# EAGLE design ESP32_SimButtonBox_Controller (EAGLE 9.6.2)
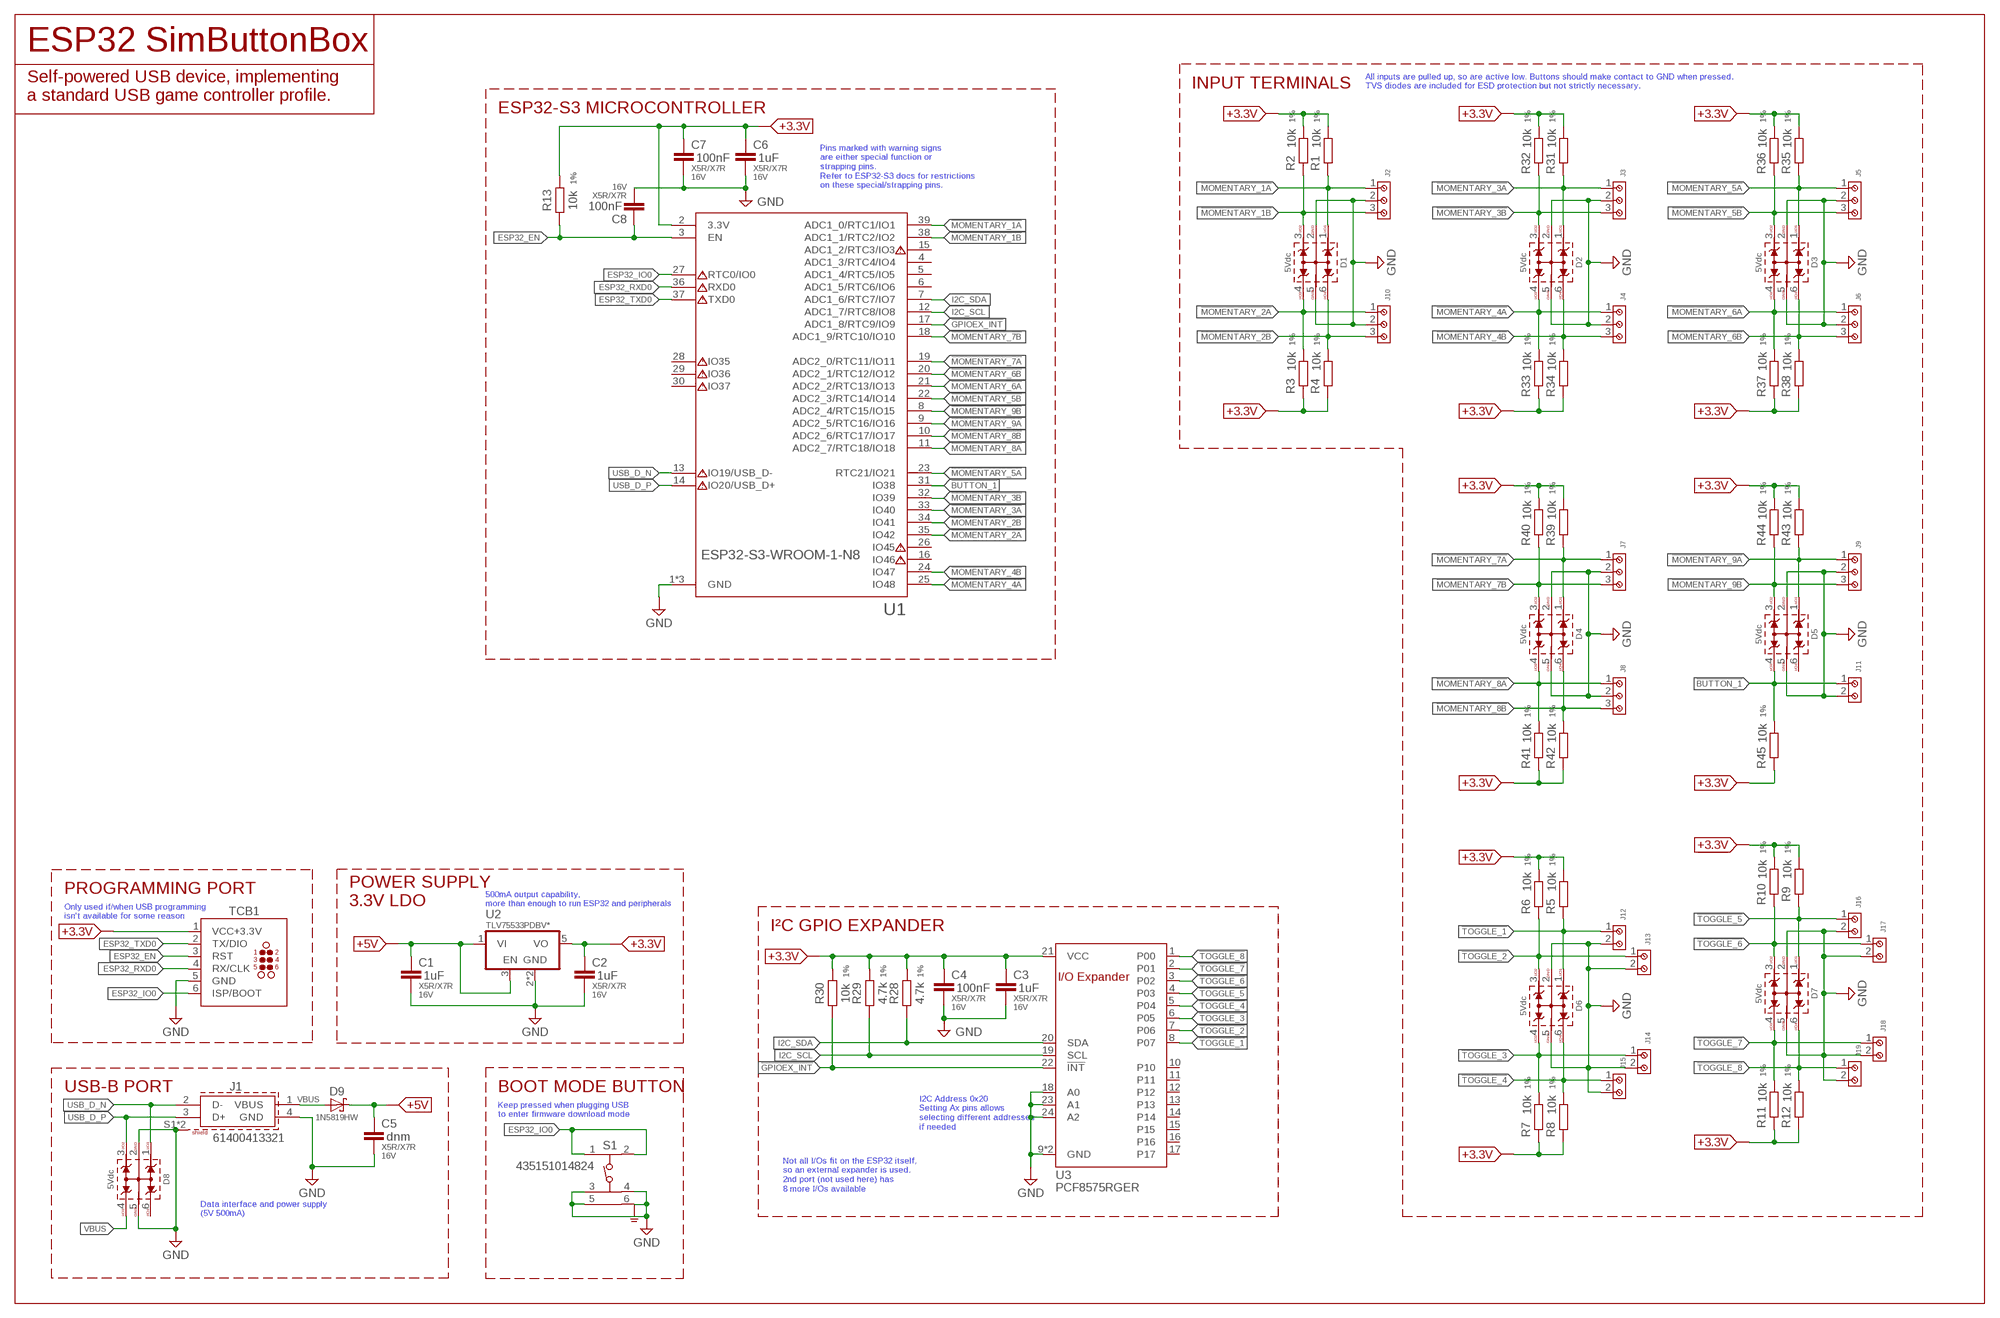
[diagram p0: schematic, sheet 1]

## Parts
C1  1uF  CAP_0603  [C0603]
C2  1uF  CAP_0603  [C0603]
C3  1uF  CAP_0603  [C0603]
C4  100nF  CAP_0603  [C0603]
C5  dnm  CAP_0603  [C0603]
C6  1uF  CAP_0603  [C0603]
C7  100nF  CAP_0603  [C0603]
C8  100nF  CAP_0603  [C0603]
D1  5Vdc  WE-TVS_SOT23-6L_82402304  [WE-TVS_SOT23-6L]
D2  5Vdc  WE-TVS_SOT23-6L_82402304  [WE-TVS_SOT23-6L]
D3  5Vdc  WE-TVS_SOT23-6L_82402304  [WE-TVS_SOT23-6L]
D4  5Vdc  WE-TVS_SOT23-6L_82402304  [WE-TVS_SOT23-6L]
D5  5Vdc  WE-TVS_SOT23-6L_82402304  [WE-TVS_SOT23-6L]
D6  5Vdc  WE-TVS_SOT23-6L_82402304  [WE-TVS_SOT23-6L]
D7  5Vdc  WE-TVS_SOT23-6L_82402304  [WE-TVS_SOT23-6L]
D8  5Vdc  WE-TVS_SOT23-6L_82402304  [WE-TVS_SOT23-6L]
D9  1N5819HW  SCHOTTKY_SOD123  [SOD123]
J1  61400413321  [61400413321]
J2  691210910003  [691210910003]
J3  691210910003  [691210910003]
J4  691210910003  [691210910003]
J5  691210910003  [691210910003]
J6  691210910003  [691210910003]
J7  691210910003  [691210910003]
J8  691210910003  [691210910003]
J9  691210910003  [691210910003]
J10  691210910003  [691210910003]
J11  691210910002  [691210910002]
J12  691210910002  [691210910002]
J13  691210910002  [691210910002]
J14  691210910002  [691210910002]
J15  691210910002  [691210910002]
J16  691210910002  [691210910002]
J17  691210910002  [691210910002]
J18  691210910002  [691210910002]
J19  691210910002  [691210910002]
R1  10k  RES_0603  [R0603]
R2  10k  RES_0603  [R0603]
R3  10k  RES_0603  [R0603]
R4  10k  RES_0603  [R0603]
R5  10k  RES_0603  [R0603]
R6  10k  RES_0603  [R0603]
R7  10k  RES_0603  [R0603]
R8  10k  RES_0603  [R0603]
R9  10k  RES_0603  [R0603]
R10  10k  RES_0603  [R0603]
R11  10k  RES_0603  [R0603]
R12  10k  RES_0603  [R0603]
R13  10k  RES_0603  [R0603]
R28  4.7k  RES_0603  [R0603]
R29  4.7k  RES_0603  [R0603]
R30  10k  RES_0603  [R0603]
R31  10k  RES_0603  [R0603]
R32  10k  RES_0603  [R0603]
R33  10k  RES_0603  [R0603]
R34  10k  RES_0603  [R0603]
R35  10k  RES_0603  [R0603]
R36  10k  RES_0603  [R0603]
R37  10k  RES_0603  [R0603]
R38  10k  RES_0603  [R0603]
R39  10k  RES_0603  [R0603]
R40  10k  RES_0603  [R0603]
R41  10k  RES_0603  [R0603]
R42  10k  RES_0603  [R0603]
R43  10k  RES_0603  [R0603]
R44  10k  RES_0603  [R0603]
R45  10k  RES_0603  [R0603]
S1  435151014824  435151014824  [435151014824]
TCB1  TC2030-MCP-NL  [TC2030-MCP-NL]
U1  ESP32-S3-WROOM-1-N8  [WROOM-1]
U2  LDO_EN_SOT23-5  [SOT23-5]
U3  PCF8575RGE  [QFN50P400X400X100-25T210N]

## Nets
!BUTTON_1: D5.4 J11.1 R45.2 U1.31(IO38)
!GPIOEX_INT: R30.1 U1.17(ADC1_8/RTC9/IO9) U3.22(!INT)
!MOMENTARY_1A: D1.1 J2.1 R1.1 U1.39(ADC1_0/RTC1/IO1)
!MOMENTARY_1B: D1.3 J2.3 R2.1 U1.38(ADC1_1/RTC2/IO2)
!MOMENTARY_2A: D1.4 J10.1 R3.2 U1.35(IO42)
!MOMENTARY_2B: D1.6 J10.3 R4.2 U1.34(IO41)
!MOMENTARY_3A: D2.1 J3.1 R31.1 U1.33(IO40)
!MOMENTARY_3B: D2.3 J3.3 R32.1 U1.32(IO39)
!MOMENTARY_4A: D2.4 J4.1 R33.2 U1.25(IO48)
!MOMENTARY_4B: D2.6 J4.3 R34.2 U1.24(IO47)
!MOMENTARY_5A: D3.1 J5.1 R35.1 U1.23(RTC21/IO21)
!MOMENTARY_5B: D3.3 J5.3 R36.1 U1.22(ADC2_3/RTC14/IO14)
!MOMENTARY_6A: D3.4 J6.1 R37.2 U1.21(ADC2_2/RTC13/IO13)
!MOMENTARY_6B: D3.6 J6.3 R38.2 U1.20(ADC2_1/RTC12/IO12)
!MOMENTARY_7A: D4.1 J7.1 R39.1 U1.19(ADC2_0/RTC11/IO11)
!MOMENTARY_7B: D4.3 J7.3 R40.1 U1.18(ADC1_9/RTC10/IO10)
!MOMENTARY_8A: D4.4 J8.1 R41.2 U1.11(ADC2_7/RTC18/IO18)
!MOMENTARY_8B: D4.6 J8.3 R42.2 U1.10(ADC2_6/RTC17/IO17)
!MOMENTARY_9A: D5.1 J9.1 R43.1 U1.9(ADC2_5/RTC16/IO16)
!MOMENTARY_9B: D5.3 J9.3 R44.1 U1.8(ADC2_4/RTC15/IO15)
!TOGGLE_1: D6.1 J12.1 R5.1 U3.8(P07)
!TOGGLE_2: D6.3 J13.1 R6.1 U3.7(P06)
!TOGGLE_3: D6.4 J14.1 R7.2 U3.6(P05)
!TOGGLE_4: D6.6 J15.1 R8.2 U3.5(P04)
!TOGGLE_5: D7.1 J16.1 R9.1 U3.4(P03)
!TOGGLE_6: D7.3 J17.1 R10.1 U3.3(P02)
!TOGGLE_7: D7.4 J18.1 R11.2 U3.2(P01)
!TOGGLE_8: D7.6 J19.1 R12.2 U3.1(P00)
+3.3V: C2.1 C3.1 C4.1 C6.1 C7.1 R1.2 R2.2 R3.1 R4.1 R5.2 R6.2 R7.1 R8.1 R9.2 R10.2 R11.1 R12.1 R13.2 R28.2 R29.2 R30.2 R31.2 R32.2 R33.1 R34.1 R35.2 R36.2 R37.1 R38.1 R39.2 R40.2 R41.1 R42.1 R43.2 R44.2 R45.1 TCB1.1(VCC+3.3V) U1.2(3.3V) U2.5(VO) U3.21(VCC)
+5V: C1.1 C5.1 D9.C U2.1(VI) U2.3(EN)
ESP32_EN: C8.1 R13.1 TCB1.3(RST) U1.3(EN)
ESP32_IO0: S1.1 S1.2 TCB1.6(ISP/BOOT) U1.27(RTC0/IO0)
ESP32_RXD0: TCB1.4(RX/CLK) U1.36(RXD0)
ESP32_TXD0: TCB1.2(TX/DIO) U1.37(TXD0)
GND: C1.2 C2.2 C3.2 C4.2 C5.2 C6.2 C7.2 C8.2 D1.2(GND) D1.5(GND) D2.2(GND) D2.5(GND) D3.2(GND) D3.5(GND) D4.2(GND) D4.5(GND) D5.2(GND) D5.5(GND) D6.2(GND) D6.5(GND) D7.2(GND) D7.5(GND) D8.2(GND) D8.5(GND) J1.4(GND) J1.S1(SHIELD) J1.S2(SHIELD) J2.2 J3.2 J4.2 J5.2 J6.2 J7.2 J8.2 J9.2 J10.2 J11.2 J12.2 J13.2 J14.2 J15.2 J16.2 J17.2 J18.2 J19.2 S1.3 S1.4 S1.5 S1.6 TCB1.5(GND) U1.1(GND) U1.40(GND) U1.P$1(GND) U2.2(GND) U2.4(GND) U3.9(GND) U3.18(A0) U3.23(A1) U3.24(A2) U3.25(GND)
I2C_SCL: R29.1 U1.12(ADC1_7/RTC8/IO8) U3.19(SCL)
I2C_SDA: R28.1 U1.7(ADC1_6/RTC7/IO7) U3.20(SDA)
USB_D_N: D8.1 J1.2(D-) U1.13(IO19/USB_D-)
USB_D_P: D8.3 J1.3(D+) U1.14(IO20/USB_D+)
VBUS: D8.4 D9.A J1.1(VBUS)
Unconnected: D5.6 D8.6 U1.4(ADC1_3/RTC4/IO4) U1.5(ADC1_4/RTC5/IO5) U1.6(ADC1_5/RTC6/IO6) U1.15(ADC1_2/RTC3/IO3) U1.16(IO46) U1.26(IO45) U1.28(IO35) U1.29(IO36) U1.30(IO37) U3.10 U3.11 U3.12 U3.13 U3.14 U3.15 U3.16 U3.17

## Notes on the sheet
- ESP32 SimButtonBox
- INPUT TERMINALS
- All inputs are pulled up, so are active low. Buttons should make contact to GND when pressed.
  TVS diodes are included for ESD protection but not strictly necessary.
- Self-powered USB device, implementing
  a standard USB game controller profile.
- ESP32-S3 MICROCONTROLLER
- Pins marked with warning signs
  are either special function or
  strapping pins.
  Refer to ESP32-S3 docs for restrictions
  on these special/strapping pins.
- PROGRAMMING PORT
- POWER SUPPLY
  3.3V LDO
- 500mA output capability,
  more than enough to run ESP32 and peripherals
- Only used if/when USB programming
  isn't available for some reason
- I²C GPIO EXPANDER
- USB-B PORT | BOOT MODE BUTTON
- Keep pressed when plugging USB
  to enter firmware download mode
- I2C Address 0x20
  Setting Ax pins allows
  selecting different addresses
  if needed
- Not all I/Os fit on the ESP32 itself,
  so an external expander is used.
  2nd port (not used here) has 
  8 more I/Os available
- Data interface and power supply
  (5V 500mA)

## Library data of the parts
C1-C8 = Onwi.Capacitor:CAP: Capacitor; BOM_CAT: C_SMD; MATERIAL: X5R/X7R; VOLTAGE: 16V
D1-D8 = Wurth_EMC Components_WE-TVS:WE-TVS_SOT23-6L_82402304: WE-TVS TVS Diode – Standard Series Characteristics Fast turn-on Low clamping voltage High ESD withstand voltage Uni- or bidirectional protection Small package Epoxy flame resistant UL94 V-0 Applications DC power supply USB Power Delivery (PD) Headsets and accessories PDAs Digital cameras MP3-Player Touch Panels Notebooks ESD, EFT and Surge Protection ESD protection in accordance with EN 61000-4-2 – 8 kV contact discharge – 15 kV air discharge <https://www.we-online.com/catalog/media/o106433v209%20Family_WE-TVS_Standard.jpg> Details see: https://www.we-online.com/catalog/en/WE-TVS Updated by Ella Wu 2019-07-12 2019 (C) Wurth Elektronik; C-CH: 13pF; CHANNELS: 4; DATASHEET-URL: https://www.we-online.com/catalog/datasheet/82402304.pdf; DESCRIPTION: WE-TVS TVS Diode; IPEAK: 6A; MF: Wurth Elektronik; MOUNT: SMT; MP: 82402304; VBR: 6V
D9 = Onwi.Diode:SCHOTTKY: Schottky Diode; CURRENT: 1A; DESCRIPTION: Schottky diode; MP: 1N5819HW
J1 = Wurth_Connectors_WR-USB:61400413321: WR-COM USB 2.0 Type B Vertical Kind Properties Durability:1500 Mating cycles Connector Type:USB Gender:Receptacle Type:Vertical General Information Operating Temperature:-40up to +105 °C Electrical Properties Working Voltage:30V (AC) Withstanding Voltage:750V (AC) Contact Resistance:20 mΩ Material Properties Insulator Material:PBT Insulator Flammability Rating:UL94 V-0 Color:White Cover Material:Brass Cover Plating:Nickel Contact Material:Copper Alloy Contact Plating:Selective Gold Contact Type:Stamped Shielding Material:Brass Shielding Plating:Nickel <https://www.we-online.com/catalog/media/o32829v209%20Family_S290_WR-COM_USB_TypeB_61400413321_4C.jpg> Details see: https://www.we-online.com/catalog/en/COM_TYPE_B_VERTICAL/ Updated by Yingchun, Shan 2020-01-16 2020 (C) Würth Elektronik; APPLICATION: USB 2.0; DATASHEET-URL: https://www.we-online.com/catalog/datasheet/61400413321.pdf; DESCRIPTION: WR-USB Input/Output USB connectors; GERDER: Receptacle; INTERFACE-TYPE: Type B; IR1: 1.5A; MF: Wurth Elktronik; MOUNT: THT; MP: 61400413321; PACKAGING: Tray; PINS: 4; REF-EXCALIBUR: 03178; TYPE: Vertical; WORKING-VOLTAGE: 30V(AC)
J2-J10 = Wurth_Connectors_WR-TBL Rising Cage Clamp:691210910003: WR-TBL Serie 2109 - 2.54 mm Horiz. Entry KIND PROPERTIES Pitch 2.54 mm MATERIAL PROPERTIES Insulator Material PA66 Insulator Flammability Rating UL94 V-0 Insulator Color Green Contact Material Brass Contact Plating Copper over Zinc Terminal Screw Material Steel Terminal Screw Plating Zinc Wire Guard Material Brass GENERAL INFORMATION Operating Temperature -40 up to +105 °C Compliance Lead free / RoHS ELECTRICAL PROPERTIES IR cULus 6 A Working Voltage [cULus] 150 V (AC) Withstanding Voltage [cULus] 1300 V (AC) Contact Resistance [cULus] 20 mΩ MECHANICAL PROPERTIES Wire Strip Length 4 up to 5 (mm) Screw M1.6 Solid Wire Section (AWG) 30 to 18 (AWG) Solid Wire Section (Metric) 0.0509 to 0.823 (mm²) Stranded Wire Section (AWG) 30 to 18 (AWG) Stranded Wire Section (Metric) 0.0509 to 0.823 (mm²) CERTIFICATION cULus Approval E315414 PACKAGING PROPERTIES Packaging Box <https://katalog.we-online.com/media/images/v2/o33231v209%20Family_WR-TBL_69121091000x.jpg> Details see: https://katalog.we-online.com/en/em/TBL_2_54_2109_HORIZONTAL_ENTRY_69121091000X Updated by Ella Wu 2019-11-12 2019(C) Wurth Elektronik; DATASHEET-URL: https://www.we-online.com/catalog/datasheet/691210910003.pdf; DESCRIPTION: WR-TBL Rising Cage Clamp; IR-UL: 6A; MF: Wurth Elektronik; MOUNT: THT; MP: 691210910003; PINS: 3; PITCH: 2.54mm; TYPE: Horizontal; WIRE: 30 to 18 (AWG) 0.0509 to 0.823 (mm²); WORKING-VOLTAGE-UL: 150V (AC)
J11-J19 = Wurth_Connectors_WR-TBL Rising Cage Clamp:691210910002: WR-TBL Serie 2109 - 2.54 mm Horiz. Entry KIND PROPERTIES Pitch 2.54 mm MATERIAL PROPERTIES Insulator Material PA66 Insulator Flammability Rating UL94 V-0 Insulator Color Green Contact Material Brass Contact Plating Copper over Zinc Terminal Screw Material Steel Terminal Screw Plating Zinc Wire Guard Material Brass GENERAL INFORMATION Operating Temperature -40 up to +105 °C Compliance Lead free / RoHS ELECTRICAL PROPERTIES IR cULus 6 A Working Voltage [cULus] 150 V (AC) Withstanding Voltage [cULus] 1300 V (AC) Contact Resistance [cULus] 20 mΩ MECHANICAL PROPERTIES Wire Strip Length 4 up to 5 (mm) Screw M1.6 Solid Wire Section (AWG) 30 to 18 (AWG) Solid Wire Section (Metric) 0.0509 to 0.823 (mm²) Stranded Wire Section (AWG) 30 to 18 (AWG) Stranded Wire Section (Metric) 0.0509 to 0.823 (mm²) CERTIFICATION cULus Approval E315414 PACKAGING PROPERTIES Packaging Box <https://katalog.we-online.com/media/images/v2/o33231v209%20Family_WR-TBL_69121091000x.jpg> Details see: https://katalog.we-online.com/en/em/TBL_2_54_2109_HORIZONTAL_ENTRY_69121091000X Updated by Ella Wu 2019-11-12 2019(C) Wurth Elektronik; DATASHEET-URL: https://www.we-online.com/catalog/datasheet/691210910002.pdf; DESCRIPTION: WR-TBL Rising Cage Clamp; IR-UL: 6A; MF: Wurth Elektronik; MOUNT: THT; MP: 691210910002; PINS: 2; PITCH: 2.54mm; TYPE: Horizontal; WIRE: 30 to 18 (AWG) 0.0509 to 0.823 (mm²); WORKING-VOLTAGE-UL: 150V (AC)
R1-R13 R28-R45 = Onwi.Resistors:RES: Resistor; BOM_CAT: R_SMD; TOLERANCE: 1%
S1 = Wurth_Switch_WS-TASV:435151014824: WS-TASV SMT Tact Switch 3.0 x 2.6 mm with ground terminal MATERIAL PROPERTIES Cover Material Stainless Steel PROPERTIES Actuator Material LCP Actuator Flammability Rating UL94 V-0 Actuator Color White;​ Salmon;​ Black Frame Material LCP Frame Flammability Rating UL94 V-0 Frame Color Black Contact Material Stainless Steel Contact Plating Silver Terminal Material Copper Alloy Terminal Plating Silver VR 12 V (DC) Contact Resistance Initial 100 mΩ Contact Resistance After Life Test 2 Ω RISO 100 MΩ Withstanding Voltage 250 V (AC) Washable No Qty. 9500 GENERAL INFORMATION Operating Temperature -40 up to +85 °C PACKAGING PROPERTIES Packaging Tape and Reel <https://www.we-online.com/catalog/media/o158914v209%20WS-TASV-4351x10148xx_a.jpg> Details see: https://katalog.we-online.com/en/em/WS_TASV_SMT_TACT_SWITCH_3_x_2_6 Updated by Ella Wu 2020-11-18 2020(C) Wurth Elektronik; DATASHEET-URL: https://www.we-online.com/catalog/datasheet/435151014824 .pdf; DESCRIPTION: WS-TASV Switches - Tact Switches; H: 1.4mm; MF: Wurth Elektronik; MP: 435151014824; OPERATION-FORCE: 240g
TCB1 = Onwi.Connector:TC2030: TAG-CONNECT ICSP Connector; NOT_IN_BOM: true
U1 = Onwi.Microcontroller:ESP32-S3-WROOM-1: Module Overview Features CPU and On-Chip Memory • ESP32-S3 series of SoCs embedded, Xtensa® dual-core 32-bit LX7 microprocessor, up to 240 MHz • 384 KB ROM • 512 KB SRAM • 16 KB SRAM in RTC • Up to 8 MB PSRAM Wi-Fi • 802.11 b/g/n • Bit rate: 802.11n up to 150 Mbps • A-MPDU and A-MSDU aggregation • 0.4 µs guard interval support • Center frequency range of operating channel: 2412 ~ 2484 MHz Bluetooth • Bluetooth LE: Bluetooth 5, Bluetooth mesh • Speed: 125 Kbps, 500 Kbps, 1 Mbps, 2 Mbps • Advertising extensions • Multiple advertisement sets • Channel selection algorithm #2 • Internal co-existence mechanism between Wi-Fi and Bluetooth to share the same antenna Peripherals • GPIO, SPI, LCD interface, Camera interface, UART, I2C, I2S, remote control, pulse counter,LED PWM, USB 1.1 OTG, USB Serial/JTAG controller, MCPWM, SDIO host, GDMA, TWAI® controller (compatible with ISO 11898-1), ADC, touch sensor, temperature sensor, timers and watchdogs Integrated Components on Module • 40 MHz crystal oscillator • Up to 16 MB Quad SPI flash Antenna Options • On-board PCB antenna (ESP32-S3-WROOM-1) • External antenna via a connector (ESP32-S3-WROOM-1U) Operating Conditions • Operating voltage/Power supply: 3.0 ~ 3.6 V • Operating ambient temperature: – 65 °C version: –40 ~ 65 °C – 85 °C version: –40 ~ 85 °C – 105 °C version: –40 ~ 105 °C Certification • RF certification: See certificates • Green certification: RoHS/REACH; DESCRIPTION: Modules multiprotocoles SMD Module, ESP32-S3, 8 MB SPI Flash, PCB Antenna; MF: Espressif Systems; MP: ESP32-S3-WROOM-1-N8
U2 = Onwi.LDO:LDO_EN: LDO with Enable pin; DESCRIPTION: LDO; IOUT: 500mA; MF: Texas Instruments; MP: TLV75533PDBV*; VMAX: 5.5V; VMIN: 1.45V
U3 = Onwi.GPIO_Expander:PCF8575: Texas Instruments PCF8575 16-bit 2.5- to 5.5-V I2C/SMBus I/O expander with interrupt; DESCRIPTION: 16bit I2C IO Expander; MF: Texas Instruments; MP: PCF8575RGER

## Board
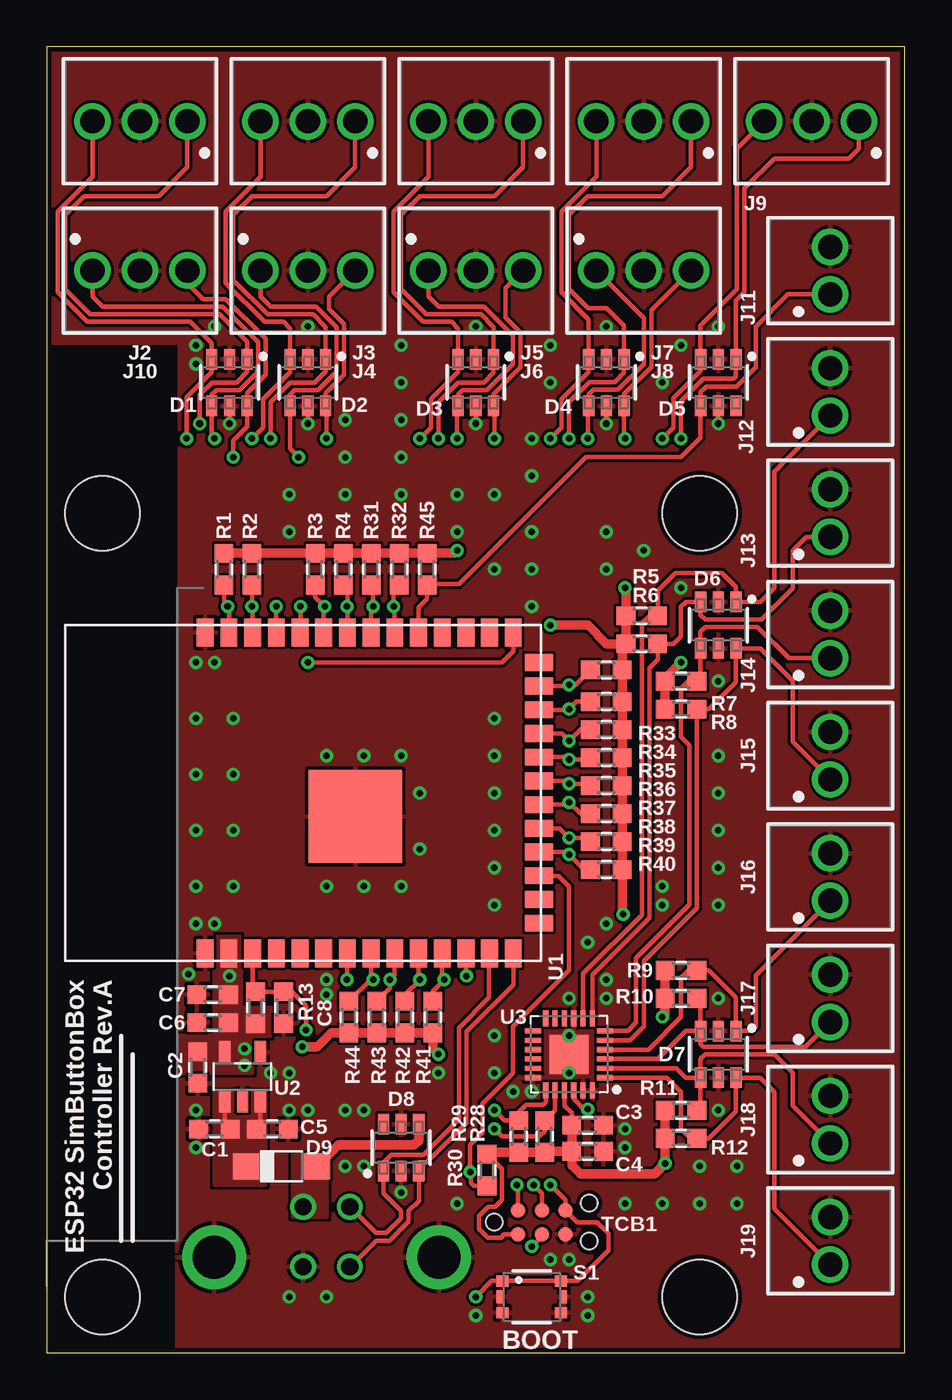
[diagram p1: board, top side]
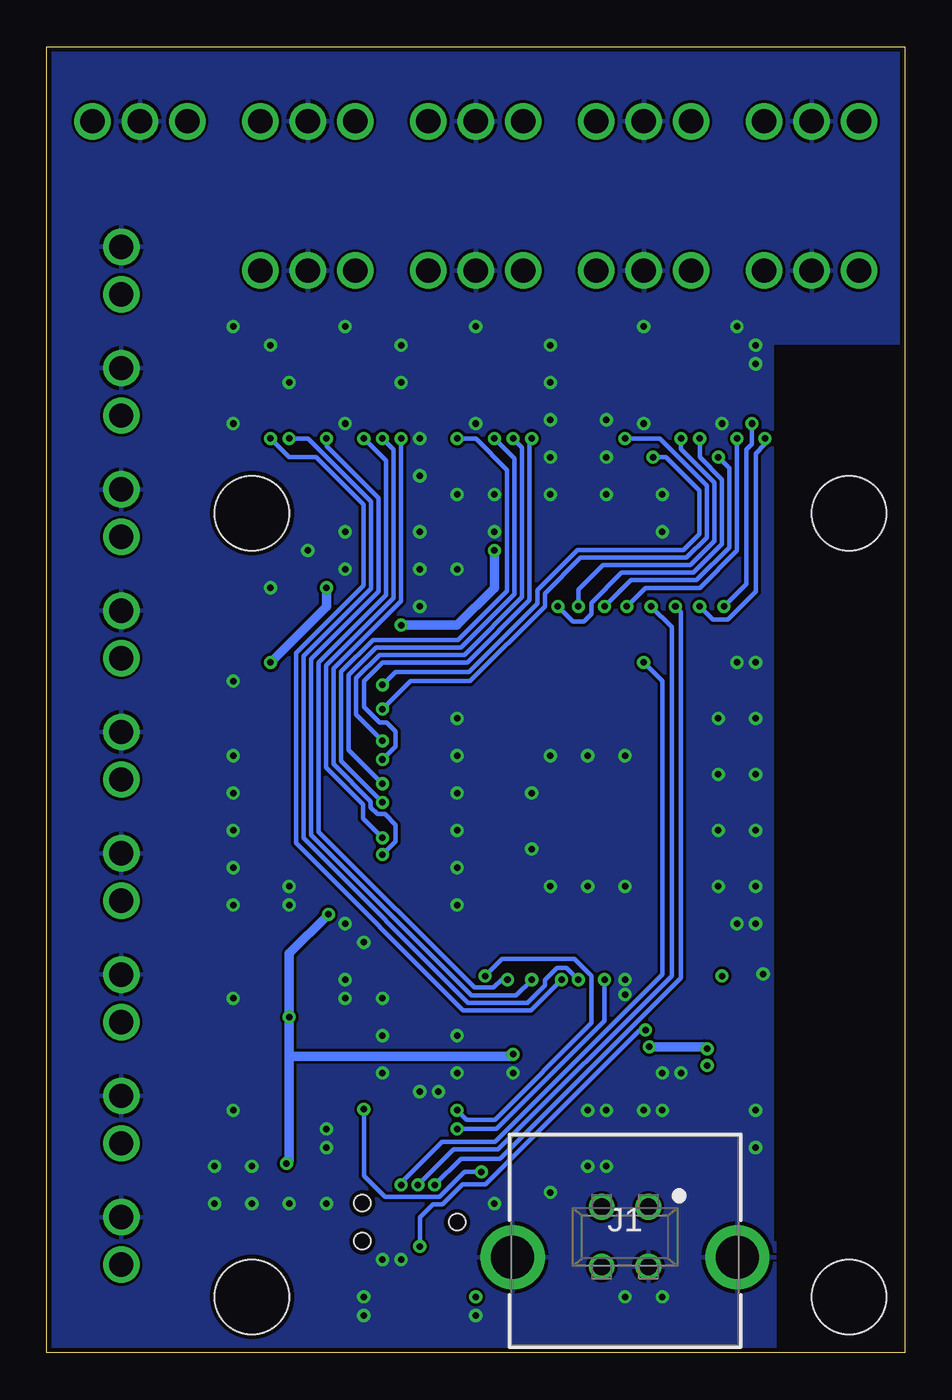
[diagram p2: board, bottom side, seen from below]

Size 46 x 70 mm. Coordinates in mm from the lower left corner, seen from the top.
Outline: 0,0 46,0 46,70 0,70 0,0
Copper layers (1*16): Top 0.018mm / dielectric 1.55mm / Bottom 0.018mm
Design rules "ONWI-2layer-Default": minimum track width 0.15mm, minimum drill 0.25mm, track to track 0.15mm, track to pad 0.15mm, pad to pad 0.15mm, via to via 0.15mm, smd to smd 0mil, copper to edge 0.25mm, drill to drill 0.35mm, minimum pad ring 0.175mm, minimum via ring 0.175mm, stop-mask expansion 0mil, vias tented up to drill 0.45mm, thermal gap 0.2mm
Holes 4 mm at 3,3 35,3 3,45 35,45

### Footprints (pad centres in the part's own frame; a part is rotated, then mirrored left to right if it is on the bottom)
C0603 = smd 1 x 1: 1 -0.85,0; 2 0.85,0
WE-TVS_SOT23-6L = smd 0.6 x 1.1: 1 -0.95,-1.25; 2 0,-1.25; 3 0.95,-1.25; 4 0.95,1.25; 5 0,1.25; 6 -0.95,1.25
SOD123 = smd 1.4 x 1.4: A 1.9,0; C -1.9,0
61400413321 = drill 0.92: 1 1.25,1.82; 2 -1.25,1.82; 3 -1.25,-1.38; 4 1.25,-1.38 | drill 2.3: S1 -6.02,-0.88; S2 6.02,-0.88
691210910003 = drill 1.3: 1 -2.54,0; 2 0,0; 3 2.54,0
691210910002 = drill 1.3: 1 -1.27,0; 2 1.27,0
R0603 = smd 1 x 1: 1 -0.85,0; 2 0.85,0
435151014824 = smd 0.65 x 0.6: 1 -1.575,0.85; 2 1.575,0.85; 3 -1.575,-0.85; 4 1.575,-0.85 | smd 0.35 x 0.7: 5 -1.725,0; 6 1.725,0
TC2030-MCP-NL = smd 0.787 x 0.787: 1 1.27,-0.635; 2 1.27,0.635; 3 2.54,-0.635; 4 2.54,0.635; 5 3.81,-0.635; 6 3.81,0.635 | hole 0.889: 0,0; 5.08,-1.016; 5.08,1.016
WROOM-1 = smd 1.5 x 0.9: 1 -8.6,5; 2 -8.6,3.73; 3 -8.6,2.46; 4 -8.6,1.19; 5 -8.6,-0.08; 6 -8.6,-1.35; 7 -8.6,-2.62; 8 -8.6,-3.89; 9 -8.6,-5.16; 10 -8.6,-6.43; 11 -8.6,-7.7; 12 -8.6,-8.97; 13 -8.6,-10.24; 14 -8.6,-11.51; 27 8.6,-11.51; 28 8.6,-10.24; 29 8.6,-8.97; 30 8.6,-7.7; 31 8.6,-6.43; 32 8.6,-5.16; 33 8.6,-3.89; 34 8.6,-2.62; 35 8.6,-1.35; 36 8.6,-0.08; 37 8.6,1.19; 38 8.6,2.46; 39 8.6,3.73; 40 8.6,5 | smd 0.9 x 1.5: 15 -6.97,-12.9; 16 -5.7,-12.9; 17 -4.43,-12.9; 18 -3.16,-12.9; 19 -1.89,-12.9; 20 -0.62,-12.9; 21 0.65,-12.9; 22 1.92,-12.9; 23 3.19,-12.9; 24 4.46,-12.9; 25 5.73,-12.9; 26 7,-12.9 | smd 5 x 5: P$1 -1.25,-3.05
SOT23-5 = smd 0.6 x 1.2: 1 -0.95,-1.306; 2 0,-1.306; 3 0.95,-1.306; 4 0.95,1.306; 5 -0.95,1.306
QFN50P400X400X100-25T210N = smd 0.86 x 0.27: 1 -1.935,1.25; 2 -1.935,0.75; 3 -1.935,0.25; 4 -1.935,-0.25; 5 -1.935,-0.75; 6 -1.935,-1.25; 13 1.935,-1.25; 14 1.935,-0.75; 15 1.935,-0.25; 16 1.935,0.25; 17 1.935,0.75; 18 1.935,1.25 | smd 0.27 x 0.86: 7 -1.25,-1.935; 8 -0.75,-1.935; 9 -0.25,-1.935; 10 0.25,-1.935; 11 0.75,-1.935; 12 1.25,-1.935; 19 1.25,1.935; 20 0.75,1.935; 21 0.25,1.935; 22 -0.25,1.935; 23 -0.75,1.935; 24 -1.25,1.935 | smd 2.1 x 2.1: 25 0,0

### Placement (x,y rotation side)
C1  9,12 180 top
C2  8.1,15.3 270 top
C3  29,12.2 0 top
C4  29,10.8 0 top
C5  12.1,12 0 top
C6  8.9,17.7 180 top
C7  8.9,19.2 180 top
C8  12.7,18.5 270 top
D1  9.8,52 180 top
D2  14,52 180 top
D3  23,52 180 top
D4  30,52 180 top
D5  36,52 180 top
D6  36,39 180 top
D7  36,16 180 top
D8  19,11 0 top
D9  12.6,10 0 top
J1  15,6 0 bottom
J2  5,66 180 top
J3  14,66 180 top
J4  14,58 0 top
J5  23,66 180 top
J6  23,58 0 top
J7  32,66 180 top
J8  32,58 0 top
J9  41,66 180 top
J10  5,58 0 top
J11  42,58 90 top
J12  42,51.5 90 top
J13  42,45 90 top
J14  42,38.5 90 top
J15  42,32 90 top
J16  42,25.5 90 top
J17  42,19 90 top
J18  42,12.5 90 top
J19  42,6 90 top
R1  9.5,42 90 top
R2  11,42 90 top
R3  14.4,42 270 top
R4  15.9,42 270 top
R5  31.9,39.5 180 top
R6  31.9,38 180 top
R7  34,36 0 top
R8  34,34.5 0 top
R9  34,20.5 180 top
R10  34,19 180 top
R11  34,13 0 top
R12  34,11.5 0 top
R13  11.2,18.5 270 top
R28  26.7,11.6 270 top
R29  25.3,11.6 270 top
R30  23.6,9.8 90 top
R31  17.4,42 90 top
R32  18.9,42 90 top
R33  30,36.6 180 top
R34  30,34.9 180 top
R35  30,33.4 0 top
R36  30,31.9 0 top
R37  30,30.4 180 top
R38  30,28.9 180 top
R39  30,27.4 0 top
R40  30,25.9 0 top
R41  20.7,18 90 top
R42  19.2,18 90 top
R43  17.7,18 270 top
R44  16.2,18 270 top
R45  20.4,42 270 top
S1  26,3 0 top
TCB1  24,7 0 top
U1  13.5,30 90 top
U2  10.5,14.8 0 top
U3  28,16 180 top
U$1  [PCB-SPEC]  60,0 0 top  (outside the outline)

### Tracks (layer width: path | path; a pad name or v marks a point on that pad's centre or on a via)
!BUTTON_1
  Top 0.254: J11.1 39.73,56.73 38,55 38,52.83 36.97,51.79 35.37,51.79 35.05,51.48 D5.4 35.05,49.05 34,48 28.9,48 22.1,41.2 20.45,41.2 R45.2 20.4,40.4 19.93,39.93 U1.31
!GPIOEX_INT  (via drill 0.35)
  Top 0.254: v29,13.06 28.8,13.06 28.25,13.61 U3.22 | R30.1 22.9,8.95 22.75,9.1 22.75,9.65 v22.7,9.7 22.7,11.14 23.37,11.81 23.37,13.37 25,15 25,17.5 28,20.5 28,25 27.43,25.57 U1.17
  Bottom 0.254: v22.7,9.7 23.61,9.7 24.94,8.37 27.87,8.37 29,9.5 v29,13.06
!MOMENTARY_1A  (via drill 0.35)
  Top 0.254: J2.1 7.54,63.54 6,62 2,62 1,61 1,57 2.34,55.66 9.27,55.66 10.75,54.18 D1.1 10.75,52.58 10.17,52 8.86,52 8.2,51.34 v8.2,49.8 | U1.39 9.77,39.93 v9.7,40 9.5,40.2 R1.1
  Bottom 0.254: v8.2,49.8 8.2,48.7 8.5,48.4 8.5,41.2 v9.7,40
!MOMENTARY_1B  (via drill 0.35)
  Top 0.254: J2.3 2.46,63.03 0.6,61.17 0.6,56.83 2.17,55.25 7.7,55.25 8.85,54.1 D1.3 8.85,52.56 7.5,51.21 v7.5,49 | U1.38 11.04,39.96 v11,40 R2.1
  Bottom 0.254: v7.5,49 7.5,48.7 8,48.2 8,40.8 9.5,39.3 10.3,39.3 v11,40
!MOMENTARY_2A  (via drill 0.35)
  Top 0.254: J10.1 2.46,56.6 3,56.06 9.44,56.06 11.33,54.17 11.33,52.59 10.34,51.6 9.1,51.6 8.85,51.35 D1.4 8.85,49.15 v9,49 | U1.35 14.85,39.95 v14.9,40 14.4,40.5 R3.2
  Bottom 0.254: v14.9,40 13.9,41 11,41 9,43 v9,49
!MOMENTARY_2B  (via drill 0.35)
  Top 0.254: J10.3 7.54,57.33 8.4,56.47 9.61,56.47 11.73,54.34 11.73,52.42 10.75,51.44 D1.6 10.75,49.65 10,48.9 v10,48 | U1.34 16.12,39.98 | 16.12,39.98 v16.1,40 | R4.2 16.12,40.93 16.12,39.98
  Bottom 0.254: v16.1,40 14.7,41.4 11.17,41.4 9.4,43.17 9.4,47.4 v10,48
!MOMENTARY_3A  (via drill 0.35)
  Top 0.254: J3.1 16.54,63.54 15,62 11,62 10,61 10,57.5 11.84,55.66 14.27,55.66 14.95,54.98 D2.1 14.95,52.58 14.37,52 13.06,52 12,50.94 v12,49 | U1.33 17.39,39.89 v17.5,40 17.5,41.05 R31.1
  Bottom 0.254: v17.5,40 17.5,40.9 16.19,42.21 11.5,42.21 10.21,43.5 10.21,46.64 12,48.43 v12,49
!MOMENTARY_3B  (via drill 0.35)
  Top 0.254: J3.3 11.46,63.03 9.59,61.17 9.59,57.33 11.67,55.25 12.7,55.25 13.05,54.9 D2.3 13.05,52.56 11.6,51.11 11.6,49.6 v11,49 | U1.32 18.66,39.94 v18.6,40 18.6,40.85 R32.1
  Bottom 0.254: v18.6,40 17.8,39.2 17.2,39.2 16.8,39.6 16.8,40.19 15.18,41.81 11.34,41.81 9.81,43.34 9.81,46.81 11,48 v11,49
!MOMENTARY_4A  (via drill 0.35)
  Top 0.254: J4.1 11.46,56.61 12.01,56.06 14.44,56.06 15.53,54.97 15.53,52.59 14.54,51.6 13.3,51.6 13,51.3 13,50.8 D2.4 13.05,48.45 v13.5,48 | U1.25 27.93,35.73 v28,35.8 28.35,35.8 R33.2
  Bottom 0.254: v13.5,48 12.8,48 11.02,46.22 11.02,43.87 11.87,43.02 17.55,43.02 19.7,40.87 19.7,40.17 23.37,36.5 27.3,36.5 v28,35.8
!MOMENTARY_4B  (via drill 0.35)
  Top 0.254: J4.3 15.14,56.6 15.14,55.94 15.93,55.14 15.93,52.42 14.95,51.44 D2.6 15,50.7 v15,49 | U1.24 27.96,34.46 v28,34.5 28.4,34.9 R34.2
  Bottom 0.254: v28,34.5 26.5,36 23.3,36 19.3,40 19.3,40.7 17.38,42.62 11.7,42.62 10.62,43.7 10.62,46.47 13.14,49 v15,49
!MOMENTARY_5A  (via drill 0.35)
  Top 0.254: J5.1 25.54,63.54 24,62 20,62 19,61 19,57 20.34,55.66 23.27,55.66 23.95,54.98 D3.1 23.95,52.52 23.43,52 22.06,52 21,50.94 v21,49 | U1.23 27.61,33.19 v28,32.8 28.6,33.4 R35.1
  Bottom 0.254: v28,32.8 29.4,34.2 29.4,36.17 28.17,37.4 23.61,37.4 20.51,40.5 20.51,48.51 v21,49
!MOMENTARY_5B  (via drill 0.35)
  Top 0.254: J5.3 20.46,63.03 18.59,61.17 18.59,56.83 20.17,55.25 21.7,55.25 22.05,54.9 D3.3 22.05,52.56 20.6,51.11 20.6,49.6 v20,49 | U1.22 27.88,31.92 v28,31.8 29.05,31.8 R36.1
  Bottom 0.254: v28,31.8 27.3,32.5 27.3,33.3 27.77,33.77 28.16,33.77 29,34.61 29,36 28,37 23.44,37 20.11,40.34 20.11,48.89 v20,49
!MOMENTARY_6A  (via drill 0.35)
  Top 0.254: J6.1 20.46,56.6 21,56.06 23.44,56.06 25,54.51 25,53 23.6,51.6 22.3,51.6 22.05,51.35 D3.4 22,50.7 v22,49 | U1.21 27.85,30.65 v28,30.5 29.05,30.5 R37.2
  Bottom 0.254: v28,30.5 29.81,32.31 29.81,36.34 28.34,37.81 23.78,37.81 20.92,40.67 20.92,47.92 v22,49
!MOMENTARY_6B  (via drill 0.35)
  Top 0.254: J6.3 24.6,57.06 24.6,55.48 25.41,54.67 25.41,52.83 23.95,51.38 D3.6 24,50.7 v24,49 | U1.20 27.88,29.38 v28,29.5 28.6,28.9 R38.2
  Bottom 0.254: v28,29.5 30.21,31.71 30.21,36.5 28.5,38.21 23.95,38.21 21.32,40.84 21.32,47.32 23,49 v24,49
!MOMENTARY_7A  (via drill 0.35)
  Top 0.254: J7.1 34.54,63.54 33,62 29,62 28,61 28,57 29,56 30,56 30.95,55.05 D4.1 30.95,52.52 30.45,52.02 29.08,52.02 28,50.94 v28,49 | U1.19 27.49,28.11 v28,27.6 28.95,27.6 R39.1
  Bottom 0.254: v28,27.6 29.03,28.63 29.03,29.39 31.02,31.38 31.02,36.84 27.4,40.45 27.4,48.4 v28,49
!MOMENTARY_7B  (via drill 0.35)
  Top 0.254: J7.3 29.46,63.03 27.59,61.17 27.59,56.83 29.05,55.38 D4.3 29.05,52.56 27.6,51.11 27.6,49.6 v27,49 | U1.18 27.86,26.84 v28,26.7 28.8,25.9 R40.1
  Bottom 0.254: v28,26.7 27.3,27.4 27.3,28.3 27.87,28.87 28.26,28.87 28.63,29.24 28.63,29.56 30.62,31.55 30.62,36.67 27,40.28 v27,49
!MOMENTARY_8A  (via drill 0.35)
  Top 0.254: J8.1 32,55.46 32,53 30.62,51.62 29.32,51.62 29.05,51.35 D4.4 29,50.7 v29,49 | U1.11 21.2,20.1 v21.3,20 20.7,19.4 R41.2
  Bottom 0.254: v21.3,20 21.61,20 22.04,19.57 23.07,19.57 31.42,27.92 31.42,37 27.81,40.62 27.81,47.81 v29,49
!MOMENTARY_8B  (via drill 0.35)
  Top 0.254: J8.3 32.41,55.87 32.41,52.83 30.95,51.38 D4.6 30.95,49.05 v31,49 | U1.10 19.93,20.07 v20,20 19.2,19.2 R42.2
  Bottom 0.254: v20,20 20.83,19.17 23.24,19.17 31.83,27.76 31.83,37.17 28.21,40.79 28.21,45.81 31,48.6 v31,49
!MOMENTARY_9A  (via drill 0.35)
  Top 0.254: J9.1 43.54,64.54 43,64 39,64 37.41,62.41 37.41,56.83 36.95,56.38 D5.1 36.95,52.35 36.8,52.2 35.2,52.2 34,51 v34,49 | U1.9 18.66,20.26 v18.4,20 18.4,19.55 R43.1
  Bottom 0.254: v18.4,20 20.04,18.36 23.68,18.36 32.64,27.32 32.64,37.51 29.02,41.12 29.02,45.45 31.57,48 33,48 v34,49
!MOMENTARY_9B  (via drill 0.35)
  Top 0.254: J9.3 37,64.54 37,57 35.05,55.05 D5.3 35.05,52.62 33.59,51.17 33.59,49.59 v33,49 | U1.8 17.39,20.11 v17.5,20 17.35,20 R44.1
  Bottom 0.254: v17.5,20 18.13,20.63 18.66,20.63 19.3,19.99 19.3,19.7 20.23,18.77 23.41,18.77 32.23,27.59 32.23,37.34 28.62,40.95 28.62,45.62 32,49 v33,49
!TOGGLE_1
  Top 0.254: U3.8 28.75,20.32 31.89,23.47 31.89,36.87 31.9,36.88 31.9,39.1 32.3,39.5 R5.1 32.75,40.85 33.7,41.8 36.2,41.8 36.95,41.05 D6.1 38.25,40.25 39,41 39,47.23 J12.1
!TOGGLE_2
  Top 0.254: U3.7 29.25,20.25 32.3,23.3 32.3,36.7 32.75,37.15 R6.1 33.6,38 34,38.4 34,40 34.25,40.25 D6.3 35.05,39.55 35.3,39.3 38.3,39.3 40,41 40,43 40.73,43.73 J13.1
!TOGGLE_3
  Top 0.254: U3.6 31.14,17.25 31.59,17.7 31.59,21.17 34.44,24.02 34.44,32.56 34,33 34,35.6 34.4,36 R7.2 35.05,36.2 D6.4 35.05,38.65 35.3,38.9 38.1,38.9 39.77,37.23 J14.1
!TOGGLE_4
  Top 0.254: U3.5 31.25,16.75 32,17.5 32,21 34.85,23.85 R8.2 35.5,34.5 36.95,35.95 D6.6 38.25,37.75 40,36 40,32.73 J15.1
!TOGGLE_5
  Top 0.254: U3.4 32.25,16.25 34,18 34,20.1 34.4,20.5 R9.1 35.5,20.5 36.95,19.05 D7.1 37.75,17.25 38,17.5 38,20.23 J16.1
!TOGGLE_6
  Top 0.254: U3.3 32.75,15.75 34.25,17.25 D7.3 | R10.1 35.05,18.8 D7.3 | J17.1 40.67,16.4 35.2,16.4 35.05,16.55 D7.3
!TOGGLE_7
  Top 0.254: R11.2 35.05,13.2 D7.4 | U3.2 33.75,15.25 34.25,14.75 D7.4 | J18.1 40,13.23 40,15 39,16 35.3,16 35.05,15.75 D7.4
!TOGGLE_8
  Top 0.254: U3.1 33.25,14.75 34,14 34,12 34.5,11.5 R12.2 35.5,11.5 36.95,12.95 D7.6 38.25,14.75 39,14 39,7.73 J19.1
+3.3V  (via drill 0.35)
  Top 0.254: U3.21 27.75,13.25 28.15,12.85 C3.1 | TCB1.1 24.53,6.37 24.34,6.18 23.66,6.18 23.18,6.66 23.18,7.34 23.66,7.82 24.02,7.82 24.4,8.2 24.4,9.85 R30.2
  Top 0.508: v13.7,16.4 14.5,16.4 15.25,17.15 R44.2 R43.2 R42.1 R41.1 20.7,16.3 v21,16 | R30.2 23.7,10.75 R29.2 R28.2 26.75,10.8 C4.1 | C3.1 C4.1 | C4.1 28.15,10.05 28.6,9.6 32.6,9.6 v33.15,10.15 R12.1 R11.1 | R9.2 R10.2 33.15,18.15 v33,18 | v30.9,23.5 30.85,23.55 R40.2 R39.2 R38.1 R37.1 R36.2 R35.2 R34.1 R33.1 30.85,37.8 R6.2 | R6.2 R5.2 31.05,40.95 v31,41 | R8.1 R7.1 33.15,36.15 v34,37 | v22,43 21.85,42.85 R45.1 R32.2 R31.2 R4.1 R3.1 R2.2 R1.2 | v27,39 29,39 30,38 R6.2
  Bottom 0.508: v13.7,16.4 10.7,16.4 v10.6,16.3 | v22,43 22,41 24,39 v27,39 | v31,41 31,40 v34,37 | v30.9,23.5 33,21.4 v33,18 33,15.9 | 33,15.9 33,10.3 v33.15,10.15 | v21,16 21.1,15.9 33,15.9
  other vias: 10.6,15.4 9.8,20.2
  pour Top (no thermals): 11,15 7,15 7,17 9,17 9,22.3 10.4,22.3 10.4,18.5 12,18.5 12,17 11,17
+5V
  Top 0.254: U2.1 9.55,12.3 C1.1 | U2.3 11.45,12.2 C5.1
  pour Top (no thermals): 10,14 10,12.7 11,12.7 11,14 11.7,14 11.7,9 9,9 9,14
ESP32_EN  (via drill 0.35)
  Top 0.254: TCB1.3 26.54,6.24 v26,5.7 | v13.9,17.3 13.9,18.6 13.15,19.35 C8.1 R13.1 11.04,19.51 U1.3
  Bottom 0.254: v26,5.7 26,7.27 25.3,7.97 24.77,7.97 23.72,9.02 22.48,9.02 14.2,17.3 v13.9,17.3
ESP32_IO0  (via drill 0.35)
  Top 0.254: v23,3 23.85,3.85 S1.1 S1.2 28.45,3.85 30.1,5.5 30.1,6.4 29.5,7 28.45,7 TCB1.6 27.81,8.19 v27,9 | U1.27 25.01,37.6 24.41,37 v14,37
  Bottom 0.254: v14,37 13,36 13,20.27 21.97,11.3 24.8,11.3 27,9.1 v27,9
ESP32_RXD0  (via drill 0.35)
  Top 0.254: TCB1.4 26.54,8.56 v26.1,9 | v13.6,40 13.6,38.62 U1.36
  Bottom 0.254: v26.1,9 24.2,10.9 21.8,10.9 12.5,20.2 12.5,38.9 v13.6,40
ESP32_TXD0  (via drill 0.35)
  Top 0.254: TCB1.2 25.27,8.93 v25.2,9 | v12.3,40 v12.31,39.99 U1.37
  Bottom 0.254: v12.3,40 12,39.7 12,20.1 21.7,10.4 23.8,10.4 v25.2,9
GND  (via drill 0.35)
  Top 0.254: D1.5 v9.8,49.8 | D2.5 v14,49.8 | D3.5 v23,49.8 | D4.5 v30,49.8 | D5.5 v36,49.8
  other vias: 19,8.6 36,55 30,55 23,55 14,55 9,55 36,36 34,41 36,19 36,13 17,13 16,13 25,14 26,14 28,15 28,17 31,12 31,11 27,5 28,5 29,2 29,3 23,2 14,13 13,13 8,13 8,11 12,15 13,15 8,23 9,23 7.6,20.3 15,25 17,25 19,25 19,32 17,32 15,32 20,30 20,27 8,37 9,37 15,20 15,19.2 21,15 24,15 24,17 22,8 35,10 37,10 33,24 33,25 30,23 29,22 32,43 30,42 26,42 26,44 30,44 26,40 24,42 24,46 22,46 19,46 19,48 22,44 13,44 13,46 16,46 16,48 19,50 16,50 19,52 19,54 8,53 8,54 8,34 8,31 8,28 10,28 10,31 10,34 8,25 10,25 24,24 24,26 24,28 24,30 24,32 24,34 27,54 27,52 26,47 26,49 33,52 34,54 36,24 36,26 36,28 36,30 36,32 31,8 33,8 35,8 37,8 13,3 15,3 28,19 30,19 30,20 16,10 17,10
  pour Top (rank 2): 7,-1 7,54 0,54 0,70 46,70 46,0 9,0 8,-1
  pour Bottom: 7,-2 7,54 0,54 0,70 46,70 46,0 10,0 8,-2
I2C_SCL  (via drill 0.35)
  Top 0.254: U3.19 26.75,13.45 26.6,13.3 25.7,13.3 25.3,12.9 R29.1 24.55,12.45 v24,13 | v22.5,20.2 22.47,20.23 U1.12
  Bottom 0.254: v24,13 23.5,12.5 21.97,12.5 16.8,17.67 16.8,20.2 17.7,21.1 21.6,21.1 v22.5,20.2
I2C_SDA  (via drill 0.35)
  Top 0.254: U3.20 27.25,13 R28.1 26.7,11.9 26.4,11.6 24.4,11.6 v24,12 | v16.1,20 16.1,21.38 U1.7
  Bottom 0.254: v24,12 21.9,12 16.1,17.8 v16.1,20
USB_D_N
  Top 0.254: U1.13 23.72,21.38 23.72,19.05 22.1,17.43 22.1,12.51 20.2,10.61 18.45,10.61 18.05,10.21 D8.1 18.05,8.55 19,7.6 19,7.22 18.2,6.42 17.65,6.42 J1.2
USB_D_P
  Top 0.254: U1.14 25.01,19.73 22.51,17.22 22.51,12.34 20.37,10.2 19.95,10.2 D8.3 19.95,8.14 19.41,7.6 19.41,7.05 18.37,6.02 17.65,6.02 J1.3
VBUS
  Top 0.508: D8.4 19.95,11.39 19.7,11.14 15.64,11.14 D9.A
  pour Top (no thermals): 15,10.6 13.2,10.6 13.2,7.3 15,7.3

### Text on the board
tPlace: ESP32 SimButtonBox / Controller Rev.A | BOOT
Reference: Standard 2-layer, 1.6mm thick PCB. | Copper keepout zone for ESP32 antenna / is present, if we want to use / either Wi-Fi or BLE | Copper keepout zone for ESP32 antenna / is present, if we want to use / either Wi-Fi or BLE